# Altium schematic sheet 04-Power_Stage.SchDoc
size B
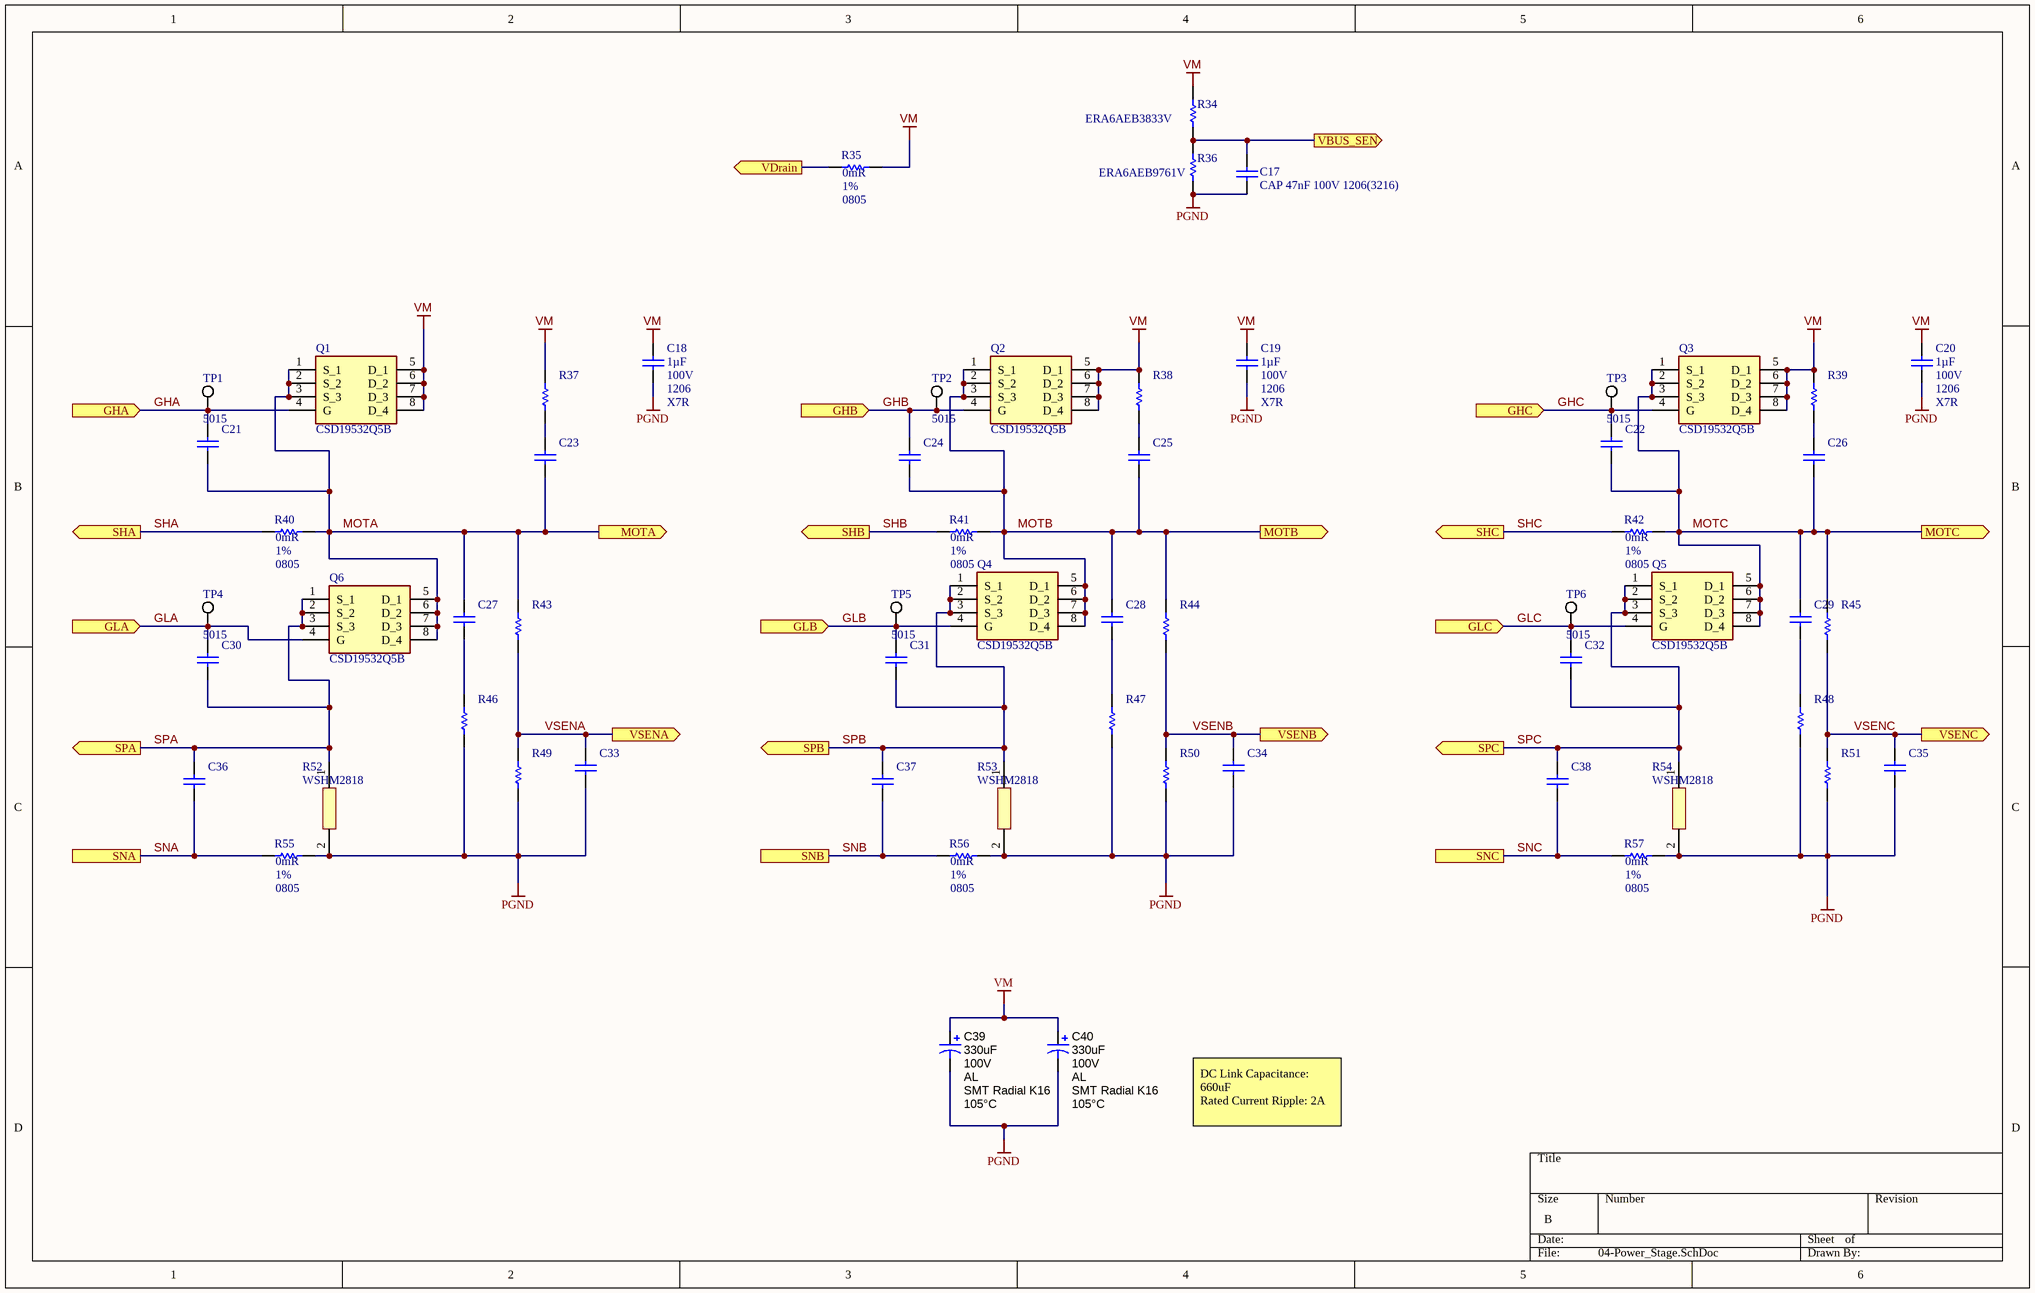
[diagram p0: 04-Power_Stage.SchDoc]

## Parts
C17  CAP 47nF 100V 1206(3216)  [CAPC1206(3216)170_N]
C18  Capacitance: 1µF  Package Reference: 1206  Voltage - Rated: 100V  Temperature Coefficient: X7R  [CAPC3216X180X20LL20]  (hidden comment: C3216X7R2A105K160AA)
C19  Capacitance: 1µF  Package Reference: 1206  Voltage - Rated: 100V  Temperature Coefficient: X7R  [CAPC3216X180X20LL20]  (hidden comment: C3216X7R2A105K160AA)
C20  Capacitance: 1µF  Package Reference: 1206  Voltage - Rated: 100V  Temperature Coefficient: X7R  [CAPC3216X180X20LL20]  (hidden comment: C3216X7R2A105K160AA)
C21  GRM188R72A222KA01D  [CAPC1608X90X35NL10T15]  (value not drawn)
C22  GRM188R72A222KA01D  [CAPC1608X90X35NL10T15]  (value not drawn)
C23  GRM188R72A222KA01D  [CAPC1608X90X35NL10T15]  (value not drawn)
C24  GRM188R72A222KA01D  [CAPC1608X90X35NL10T15]  (value not drawn)
C25  GRM188R72A222KA01D  [CAPC1608X90X35NL10T15]  (value not drawn)
C26  GRM188R72A222KA01D  [CAPC1608X90X35NL10T15]  (value not drawn)
C27  GRM188R72A222KA01D  [CAPC1608X90X35NL10T15]  (value not drawn)
C28  GRM188R72A222KA01D  [CAPC1608X90X35NL10T15]  (value not drawn)
C29  GRM188R72A222KA01D  [CAPC1608X90X35NL10T15]  (value not drawn)
C30  GRM188R72A222KA01D  [CAPC1608X90X35NL10T15]  (value not drawn)
C31  GRM188R72A222KA01D  [CAPC1608X90X35NL10T15]  (value not drawn)
C32  GRM188R72A222KA01D  [CAPC1608X90X35NL10T15]  (value not drawn)
C33  06033C473JAT2A  [CAPC1608X90X35NL15T15]  (value not drawn)
C34  06033C473JAT2A  [CAPC1608X90X35NL15T15]  (value not drawn)
C35  06033C473JAT2A  [CAPC1608X90X35NL15T15]  (value not drawn)
C36  0603YC102KAT2A  [CAPC1608X90X35NL15T15]  (value not drawn)
C37  0603YC102KAT2A  [CAPC1608X90X35NL15T15]  (value not drawn)
C38  0603YC102KAT2A  [CAPC1608X90X35NL15T15]  (value not drawn)
C39  TaMax_C: 105°C  PackageReference: SMT Radial K16  VDC_V: 100V  Technology: AL  ValueDisplayed: 330uF  [SM_RADIAL_K16]  (hidden comment: EEV-FK2A331M)
C40  TaMax_C: 105°C  PackageReference: SMT Radial K16  VDC_V: 100V  Technology: AL  ValueDisplayed: 330uF  [SM_RADIAL_K16]  (hidden comment: EEV-FK2A331M)
Q1  CSD19532Q5B  [Q5B]
Q2  CSD19532Q5B  [Q5B]
Q3  CSD19532Q5B  [Q5B]
Q4  CSD19532Q5B  [Q5B]
Q5  CSD19532Q5B  [Q5B]
Q6  CSD19532Q5B  [Q5B]
R34  ERA6AEB3833V  [RESC2013X60X40LL20T25]
R35  Case Code (Imperial): 0805  Resistance: 0mR  Tolerance: 1%  [RESC2013X50X30LL20T20]  (hidden comment: CRCW08050000Z0EA)
R36  ERA6AEB9761V  [RESC2013X60X40NL20T25]
R37  CRCW08052R70JNEA  [RESC2013X50X30NL20T20]  (value not drawn)
R38  CRCW08052R70JNEA  [RESC2013X50X30NL20T20]  (value not drawn)
R39  CRCW08052R70JNEA  [RESC2013X50X30NL20T20]  (value not drawn)
R40  Case Code (Imperial): 0805  Resistance: 0mR  Tolerance: 1%  [RESC2013X50X30LL20T20]  (hidden comment: CRCW08050000Z0EA)
R41  Case Code (Imperial): 0805  Resistance: 0mR  Tolerance: 1%  [RESC2013X50X30LL20T20]  (hidden comment: CRCW08050000Z0EA)
R42  Case Code (Imperial): 0805  Resistance: 0mR  Tolerance: 1%  [RESC2013X50X30LL20T20]  (hidden comment: CRCW08050000Z0EA)
R43  CRCW0603383KFKEA  [RESC1609X50X30ML10T20]  (value not drawn)
R44  CRCW0603383KFKEA  [RESC1609X50X30ML10T20]  (value not drawn)
R45  CRCW0603383KFKEA  [RESC1609X50X30ML10T20]  (value not drawn)
R46  CRCW08052R70JNEA  [RESC2013X50X30NL20T20]  (value not drawn)
R47  CRCW08052R70JNEA  [RESC2013X50X30NL20T20]  (value not drawn)
R48  CRCW08052R70JNEA  [RESC2013X50X30NL20T20]  (value not drawn)
R49  RC0603FR-079K76L  [RESC1608X55X25NL10T15]  (value not drawn)
R50  RC0603FR-079K76L  [RESC1608X55X25NL10T15]  (value not drawn)
R51  RC0603FR-079K76L  [RESC1608X55X25NL10T15]  (value not drawn)
R52  WSHM2818  [PCBComponent_1]
R53  WSHM2818  [PCBComponent_1]
R54  WSHM2818  [PCBComponent_1]
R55  Case Code (Imperial): 0805  Resistance: 0mR  Tolerance: 1%  [RESC2013X50X30LL20T20]  (hidden comment: CRCW08050000Z0EA)
R56  Case Code (Imperial): 0805  Resistance: 0mR  Tolerance: 1%  [RESC2013X50X30LL20T20]  (hidden comment: CRCW08050000Z0EA)
R57  Case Code (Imperial): 0805  Resistance: 0mR  Tolerance: 1%  [RESC2013X50X30LL20T20]  (hidden comment: CRCW08050000Z0EA)
TP1  5015  [KSTN-5015_V]
TP2  5015  [KSTN-5015_V]
TP3  5015  [KSTN-5015_V]
TP4  5015  [KSTN-5015_V]
TP5  5015  [KSTN-5015_V]
TP6  5015  [KSTN-5015_V]

## Ports
GHA (in), GHB (in), GHC (in), GLA (in), GLB (in), GLC (in), MOTA (out), MOTB (out), MOTC (out), SHA (out), SHB (out), SHC (out), SNA, SNB, SNC, SPA (out), SPB (out), SPC (out), VBUS_SEN (out), VDrain (out), VSENA (out), VSENB (out), VSENC (out)

## Nets
PGND: C17.1 C18.1 C19.1 C20.1 C33.1 C34.1 C35.1 C39.2(-) C40.2(-) R36.1 R46.1 R47.1 R48.1 R49.2 R50.2 R51.2 R52.2 R53.2 R54.2 R55.2 R56.2 R57.2
VM: C18.2 C19.2 C20.2 C39.1(+) C40.1(+) Q1.5(D_1) Q1.6(D_2) Q1.7(D_3) Q1.8(D_4) Q2.5(D_1) Q2.6(D_2) Q2.7(D_3) Q2.8(D_4) Q3.5(D_1) Q3.6(D_2) Q3.7(D_3) Q3.8(D_4) R34.2 R35.2 R37.2 R38.2 R39.2
GHA: C21.2 Q1.4(G) TP1.1 ; port GHA
GHB: C24.2 Q2.4(G) TP2.1 ; port GHB
GHC: C22.2 Q3.4(G) TP3.1 ; port GHC
GLA: C30.2 Q6.4(G) TP4.1 ; port GLA
GLB: C31.2 Q4.4(G) TP5.1 ; port GLB
GLC: C32.2 Q5.4(G) TP6.1 ; port GLC
MOTA: C21.1 C23.1 C27.2 Q1.1(S_1) Q1.2(S_2) Q1.3(S_3) Q6.5(D_1) Q6.6(D_2) Q6.7(D_3) Q6.8(D_4) R40.2 R43.2 ; port MOTA
MOTB: C24.1 C25.1 C28.2 Q2.1(S_1) Q2.2(S_2) Q2.3(S_3) Q4.5(D_1) Q4.6(D_2) Q4.7(D_3) Q4.8(D_4) R41.2 R44.2 ; port MOTB
MOTC: C22.1 C26.1 C29.2 Q3.1(S_1) Q3.2(S_2) Q3.3(S_3) Q5.5(D_1) Q5.6(D_2) Q5.7(D_3) Q5.8(D_4) R42.2 R45.2 ; port MOTC
SHA: R40.1 ; port SHA
SHB: R41.1 ; port SHB
SHC: R42.1 ; port SHC
SNA: C36.1 R55.1 ; port SNA
SNB: C37.1 R56.1 ; port SNB
SNC: C38.1 R57.1 ; port SNC
SPA: C30.1 C36.2 Q6.1(S_1) Q6.2(S_2) Q6.3(S_3) R52.1 ; port SPA
SPB: C31.1 C37.2 Q4.1(S_1) Q4.2(S_2) Q4.3(S_3) R53.1 ; port SPB
SPC: C32.1 C38.2 Q5.1(S_1) Q5.2(S_2) Q5.3(S_3) R54.1 ; port SPC
VBUS_SEN: C17.2 R34.1 R36.2 ; port VBUS_SEN
VDrain: R35.1 ; port VDrain
VSENA: C33.2 R43.1 R49.1 ; port VSENA
VSENB: C34.2 R44.1 R50.1 ; port VSENB
VSENC: C35.2 R45.1 R51.1 ; port VSENC
NetC23_2: C23.2 R37.1
NetC25_2: C25.2 R38.1
NetC26_2: C26.2 R39.1
NetC27_1: C27.1 R46.2
NetC28_1: C28.1 R47.2
NetC29_1: C29.1 R48.2

## Notes on the sheet
- DC Link Capacitance:
  660uF
  Rated Current Ripple: 2A

## Library data of the parts
C17 = CMP-1037-03996-1: CAP 47nF 100V ±10% 1206 (3216 Metric) Thickness 1.7mm SMD; Tolerance: Â±10%; Case-EIA: 1206; Case-Metric: 3216; Value: 47nF; Max Thickness: 1.7 mm; Technology: SMT; Rated Voltage: 100 V
C18-C20 = CMP-2000-06049-1: Chip Capacitor, 1 uF, +/- 10%, 100 V, -55 to 125 degC, 1206 (3216 Metric), RoHS, Tape and Reel; Manufacturer: TDK; PCN Part Number: MLCCPartNumberChange30/Nov/2012; Kits: SAMPLEKIT1008-ND-KITCAPCERMLCC100V-630V; Product Training Modules: SEAT,CCV,andTVCLDesignToolsGuidetoReplacinganElectrolyticCapacitorwithanMLCC; Featured Product: C-SeriesMidVoltageMLCCs; Other Names: 445-4467-1; Catalog Drawings: CSERIES_1206_1.8; Online Catalog: CSeries,MidVoltage; Features: -; Family: CeramicCapacitors; Datasheet URL: http://www.farnell.com/datasheets/1484596.pdf; Mounting Technology: SurfaceMount; Mounting Type: SurfaceMount,MLCC; Datasheet Version: 08/2011; Standard Package: 1; Package / Case: 1206(3216Metric); Thickness (Max): 0.051"(1.30mm); Size / Dimension: 0.126"Lx0.063"W(3.20mmx1.60mm); Applications: GeneralPurpose; Operating Temperature: -55°C~125°C; Packaging: CutTape(CT); Package Description: 2-Pin Surface Mount Device, Body 3.2 x 1.6 mm; Ratings: -; Series: C; Tolerance: ±10%; Manufacturer URL: http://www.tdk.com/; Lead Spacing: -; Height - Seated (Max): -; Package URL: https://product.tdk.com/info/en/documents/chara_sheet/C3216X7R1V106K160AC.pdf; Lead Style: -; Category: Capacitors; RoHS Information: RoHSCertificate-MLCC
C21-C32 = CMP-2006-02476-1: Manufacturer: Murata; Part Number: GRM188R72A222KA01D
C33-C35 = CMP-2006-04183-1: Manufacturer: AVX Interconnect / Elco; Part Number: 06033C473JAT2A
C36-C38 = CMP-2006-04486-1: Manufacturer: AVX Interconnect / Elco; Part Number: 0603YC102KAT2A
C39 C40 = CMP-0011224-2: CAP, AL, 330 uF, 100 V, +/- 20%, 0.153 ohm, AEC-Q200 Grade 2, SMD; Manufacturer: Panasonic; TaMin_C: -55°C; ESR_ohm: 1.53d; Polarized: Y; SizeAreaWB_mm2: 483; U/M: EA; Value: 330uF; SizeZ_mm: 16.5; SizeX_mm: 21; SizeY_mm: 19; Cap_Case: K16; SizeArea_mm2: 399; CompType: Capacitor; Cap_F: 330µF; IRMS_A: 9.17dA; AEC Grade: 2; AEC Category: Q200; Supplier Part Number 2: 667-EEV-FK2A331M; Publisher: Texas Instruments; Supplier 2: Mouser; RoHS: Y; Value1: 0.153 ohm; MountType: SMT; Supplier 1: Digi-Key; Tolerance_%: 20%; Value2: 100V; LatestRevisionDate: 2017-03-09; PartNumber: EEV-FK2A331M; AEC Qualified: Y; Series: FK; ComponentLink1Description: Datasheet link; Supplier Part Number 1: PCE3505CT-ND; ComponentLink1URL: https://industrial.panasonic.com/cdbs/www-data/pdf/RDE0000/ABA0000C1181.pdf
Q1-Q6 = CSD19532Q5B: Transistor; Manufacturer_Name: Texas Instruments; Datasheet Link: http://www.ti.com/lit/gpn/csd19532q5b; Manufacturer_Part_Number: CSD19532Q5B; Mouser Part Number: 595-CSD19532Q5B; Mouser Price/Stock: https://www.mouser.com/Search/Refine.aspx?Keyword=595-CSD19532Q5B
R34 = CMP-2001-00814-1: Manufacturer: Panasonic; Part Number: ERA6AEB3833V
R35 R40-R42 R55-R57 = CMP-2001-04896-1: Manufacturer: Vishay Dale; Power Rating: 125mW; Voltage Rating: 150V; Temperature Coefficient: 100ppm/°C; Part Number: CRCW08050000Z0EA; Supplier 1: Digi-Key; Supplier Part Number 1: 541-0.0ACT-ND; Manufacturer Part Number: CRCW08050000Z0EA; Stock 1: 236690; Pricing 1: 1=0.10000, 10=0.04400, 25=0.03160, 50=0.02420, 100=0.01780, 250=0.01360, 500=0.01090, 1000=0.00802 (USD); RoHS: Yes; Case/Package: 0805; Weight: 0.000194oz; Case Code (Metric): 2012; Contact Plating: Tin,Lead; Min Operating Temperature: -55°C; Max Operating Temperature: 155°C; Packaging: Tape and Reel; Composition: Thick Film; Number of Terminations: 2; Max Power Dissipation: 125mW; Package Quantity: 1; Termination: SMD/SMT; Military Standard: Not; Voltage Rating (DC): 150V; Features: Automotive AEC-Q200; Length: 2mm; Height: 0.45mm; Width: 1.25mm; Depth: 1.25mm; Radiation Hardening: No; Lead Free: Lead Free; REACH SVHC: Unknown; ComponentLink1URL: https://datasheet.ciiva.com/11811/0900766b80d98b26-11811304.pdf?src-supplier=RSComponents; ComponentLink1Description: https://datasheet.ciiva.com/11811/0900766b80d98b26-11811304.pdf?src-supplier=RSComponents; ComponentLink2URL: https://datasheet.ciiva.com/26314/fld-crcw-e3-data-en-26314630.pdf?src-supplier=Distrelec; ComponentLink2Description: https://datasheet.ciiva.com/26314/fld-crcw-e3-data-en-26314630.pdf?src-supplier=Distrelec; ComponentLink3URL: https://datasheet.ciiva.com/5543/dcrcwe3-109170-5543096.pdf?src-supplier=Mouser; ComponentLink3Description: https://datasheet.ciiva.com/5543/dcrcwe3-109170-5543096.pdf?src-supplier=Mouser; ComponentLink4URL: https://datasheet.ciiva.com/16389/dcrcwe3-16389338.pdf?src-supplier=Future+Electronics; ComponentLink4Description: https://datasheet.ciiva.com/16389/dcrcwe3-16389338.pdf?src-supplier=Future+Electronics; ComponentLink5URL: https://datasheet.ciiva.com/16719/70201119-16719706.pdf?src-supplier=Allied+Electronics; ComponentLink5Description: https://datasheet.ciiva.com/16719/70201119-16719706.pdf?src-supplier=Allied+Electronics; ComponentLink6URL: https://datasheet.ciiva.com/2463/dcrcwe3-2463037.pdf?src-supplier=Digi-Key; ComponentLink6Description: https://datasheet.ciiva.com/2463/dcrcwe3-2463037.pdf?src-supplier=Digi-Key; ComponentLink7URL: https://datasheet.ciiva.com/7841/1697337-7841629.pdf?src-supplier=Element14; ComponentLink7Description: https://datasheet.ciiva.com/7841/1697337-7841629.pdf?src-supplier=Element14; ComponentLink8URL: https://datasheet.ciiva.com/2463/dcrcwe3-2463038.pdf?src-supplier=Digi-Key; ComponentLink8Description: https://datasheet.ciiva.com/2463/dcrcwe3-2463038.pdf?src-supplier=Digi-Key; ComponentLink9URL: https://datasheet.ciiva.com/2463/dcrcwe3-2463039.pdf?src-supplier=Digi-Key; ComponentLink9Description: https://datasheet.ciiva.com/2463/dcrcwe3-2463039.pdf?src-supplier=Digi-Key; ComponentLink10URL: https://datasheet.ciiva.com/7841/1720486-7841839.pdf?src-supplier=Element14; ComponentLink10Description: https://datasheet.ciiva.com/7841/1720486-7841839.pdf?src-supplier=Element14; ComponentLink11URL: https://datasheet.ciiva.com/16883/dcrcwe3-16883622.pdf?src-supplier=Avnet+Europe; ComponentLink11Description: https://datasheet.ciiva.com/16883/dcrcwe3-16883622.pdf?src-supplier=Avnet+Europe
R36 = CMP-2001-00897-1: Manufacturer: Panasonic; Part Number: ERA6AEB9761V
R37-R39 R46-R48 = CMP-2001-03795-1: Manufacturer: Vishay Dale; Part Number: CRCW08052R70JNEA
R43-R45 = CMP-2000-03279-1: Manufacturer: Vishay Dale; Part Number: CRCW0603383KFKEA
R49-R51 = CMP-2000-04170-1: Manufacturer: Yageo; Part Number: RC0603FR-079K76L
TP1-TP6 = CMP-2000-05183-1: Test Point, White, SMT; Manufacturer: Keystone; Primary Type: PCBTestPoints; Style: Miniature; Finish Plating: SilverPlate; Material, Contact: PhosphorBronze; Material: PhosphorBronze; Datasheet URL: https://datasheet.ciiva.com/1123/5015-1123862.pdf; Thickness: 0.010In.; Manufacturer URL: http://www.keyelco.com/; Length: 0.105"(2.667mm); Datasheet Version: Mar-14; Contact Plating: Silver; Mounting Type: SurfaceMount; Termination: SMT; Type: TestPointsonTapeandReel; Height: 0.06In.; Mounting: SurfaceMount